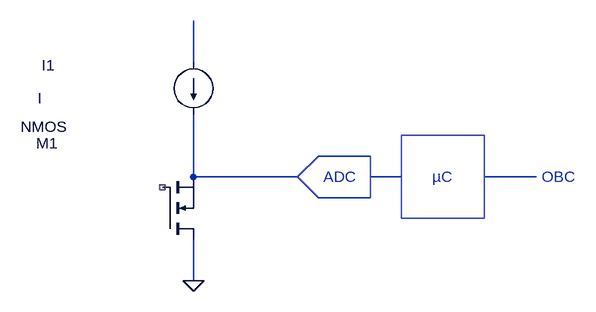
[diagram p0: schematic n-mos-temperature.asc]
n-mos-temperature.asc, the LTspice schematic file:
Version 4
SHEET 1 880 680
WIRE 16 16 16 -48
WIRE 288 160 208 160
WIRE 16 192 16 96
WIRE 176 192 16 192
WIRE 336 192 288 192
WIRE 544 192 464 192
WIRE 288 224 208 224
WIRE 16 352 16 288
FLAG 16 352 0
SYMBOL current 16 16 R0
WINDOW 0 -234 4 Left 2
WINDOW 3 -240 55 Left 2
SYMATTR InstName I1
SYMBOL nmos -32 288 M180
WINDOW 0 -194 148 Left 2
WINDOW 3 -218 173 Left 2
SYMATTR InstName M1
TEXT 216 192 Left 2 ;ADC
TEXT 384 192 Left 2 ;µC
TEXT 552 192 Left 2 ;OBC
LINE Normal 288 224 288 160
LINE Normal 208 160 176 192
LINE Normal 176 192 208 224
RECTANGLE Normal 464 256 336 128

The netlist it stands for:
* n-mos-temperature.asc
I1 N001 N003 I
M1 0 NC_01 N003 N003 NMOS
.model NMOS NMOS
.model PMOS PMOS
.lib standard.mos
* ADC
* µC
* OBC
.backanno
.end